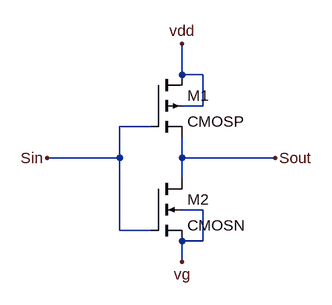
[diagram p0: schematic Draft4.asc]
Draft4.asc, the LTspice schematic file:
Version 4
SHEET 1 880 680
WIRE 160 64 160 16
WIRE 192 64 160 64
WIRE 192 112 192 64
WIRE 192 112 160 112
WIRE 112 144 64 144
WIRE 64 192 64 144
WIRE 64 192 -48 192
WIRE 160 192 160 160
WIRE 304 192 160 192
WIRE 160 224 160 192
WIRE 192 272 160 272
WIRE 64 304 64 192
WIRE 112 304 64 304
WIRE 192 320 192 272
WIRE 192 320 160 320
WIRE 160 352 160 320
FLAG 160 16 vdd
FLAG 160 352 vg
FLAG -48 192 Sin
FLAG 304 192 Sout
SYMBOL cmosp 112 64 R0
SYMATTR InstName M1
SYMATTR Value2 l=180n w=400n
SYMBOL cmosn 112 224 R0
SYMATTR InstName M2
SYMATTR Value2 l=180n w=400n

The netlist it stands for:
* Draft4.asc
M1 vdd Sin Sout vdd CMOSP l=180n w=400n
M2 Sout Sin vg vg CMOSN l=180n w=400n
.model NMOS NMOS
.model PMOS PMOS
.lib standard.mos
.backanno
.end